# EAGLE schematic PCB0M3_1C (EAGLE 6.2)

## Sheet 1 of 7
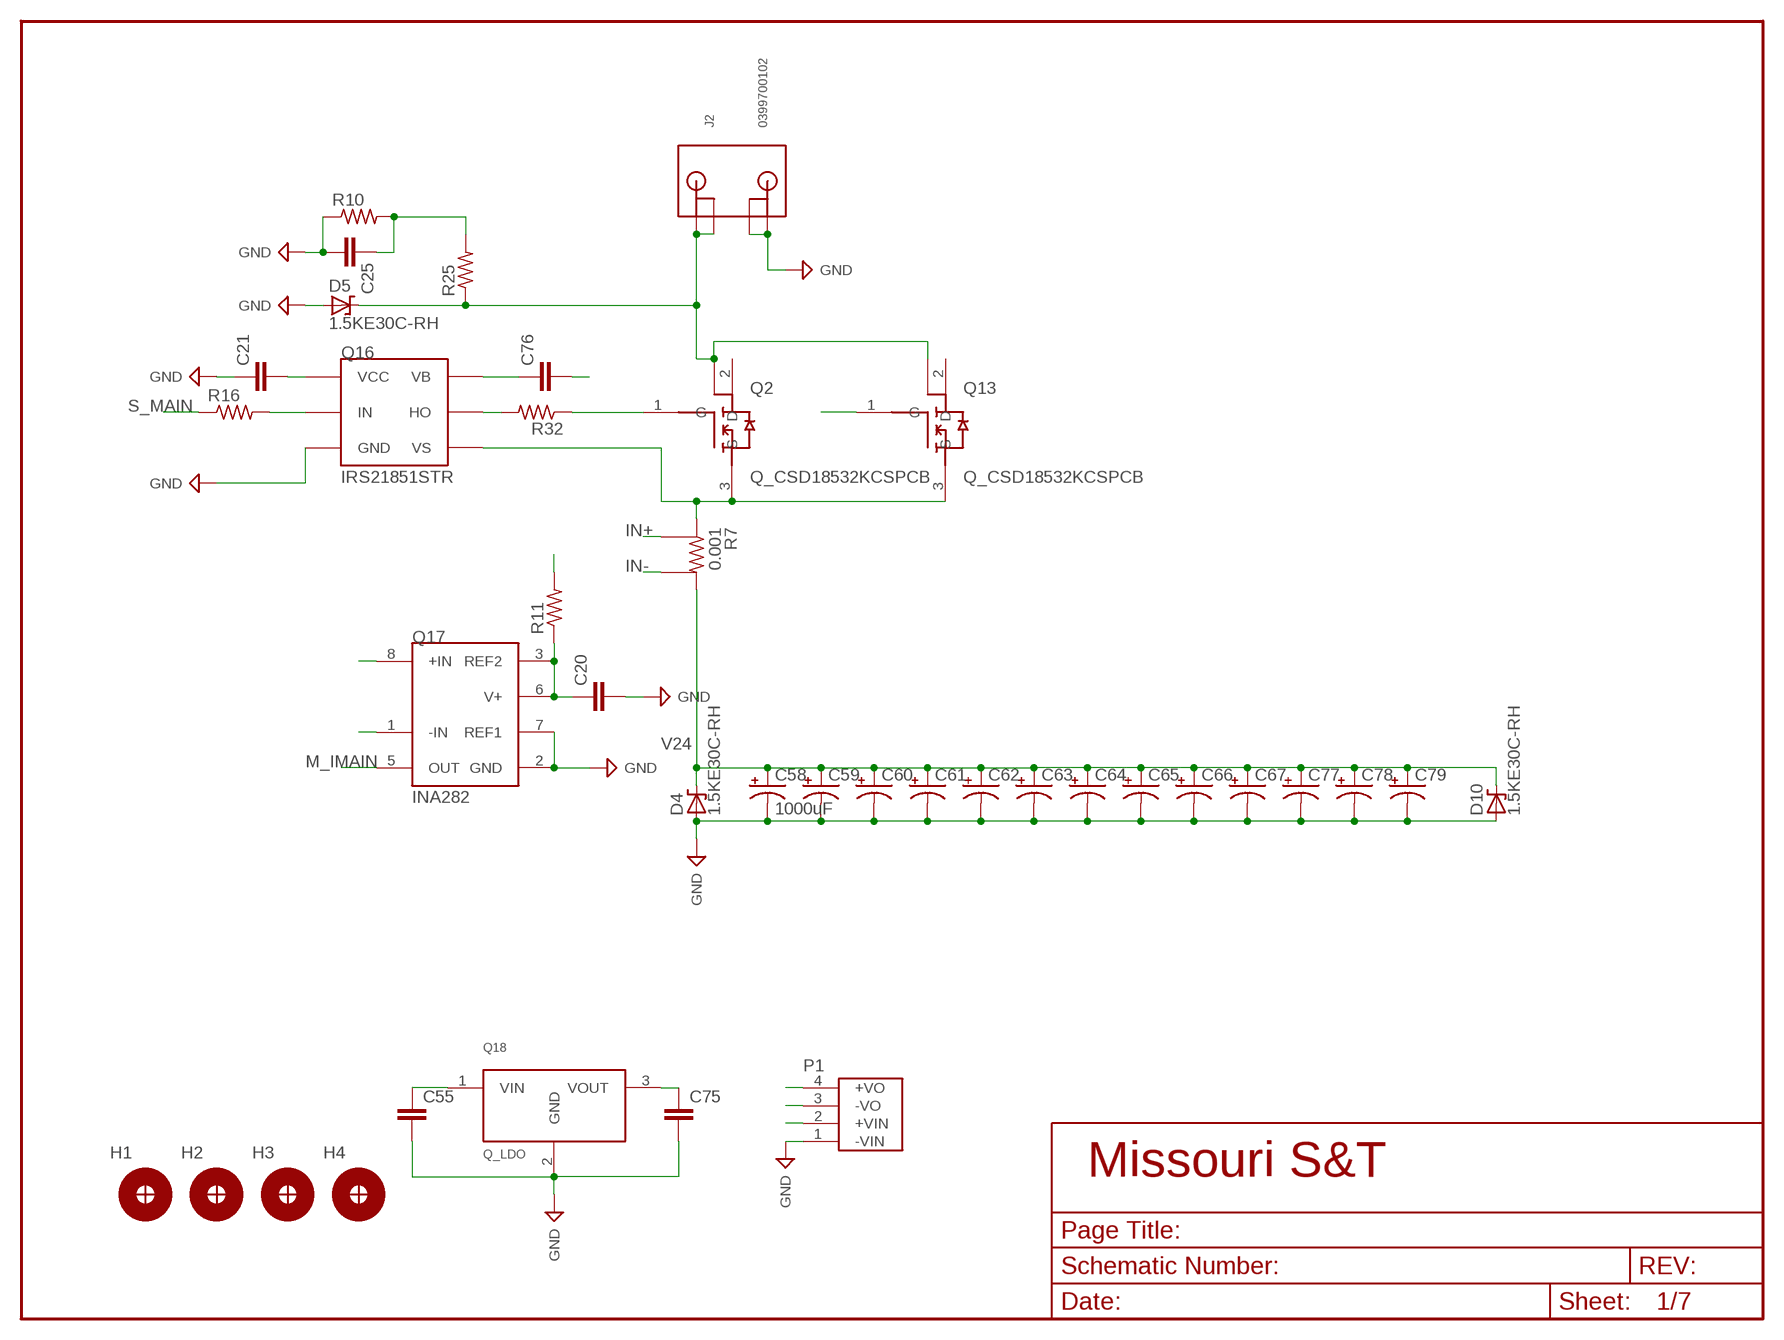
[diagram p0: schematic, sheet 1]

### Parts
C20  C_CAP_1206  [C_1206]
C21  C_CAP_1206  [C_1206]
C25  C_CAP_1206  [C_1206]
C55  C_CAP_1206  [C_1206]
C58  1000uF  C_POL10MM  [C_10MM]
C59  C_POL10MM  [C_10MM]
C60  C_POL10MM  [C_10MM]
C61  C_POL10MM  [C_10MM]
C62  C_POL10MM  [C_10MM]
C63  C_POL10MM  [C_10MM]
C64  C_POL10MM  [C_10MM]
C65  C_POL10MM  [C_10MM]
C66  C_POL10MM  [C_10MM]
C67  C_POL10MM  [C_10MM]
C75  C_CAP_1206  [C_1206]
C76  C_CAP_1206  [C_1206]
C77  C_POL10MM  [C_10MM]
C78  C_POL10MM  [C_10MM]
C79  C_POL10MM  [C_10MM]
D4  1.5KE30C-RH  D_1.5KE480A_D3.5MM_LS15.24MM  [DIODE_D3.5MM_LS15.24MM]
D5  1.5KE30C-RH  D_1.5KE480A_D3.5MM_LS15.24MM  [DIODE_D3.5MM_LS15.24MM]
D10  1.5KE30C-RH  D_1.5KE480A_D3.5MM_LS15.24MM  [DIODE_D3.5MM_LS15.24MM]
H1  H_MNTHOLE_#8  [H_MNTHOLE_#8]
H2  H_MNTHOLE_#8  [H_MNTHOLE_#8]
H3  H_MNTHOLE_#8  [H_MNTHOLE_#8]
H4  H_MNTHOLE_#8  [H_MNTHOLE_#8]
J2  0399700102  J_0399700102  [J_2CONHC]
P1  TME1215S  [TME1215S]
Q2  Q_CSD18532KCSPCB  [TO-220-FLAT]
Q13  Q_CSD18532KCSPCB  [TO-220-FLAT]
Q16  IRS21851STR  Q_IRS21851STR  [SOIC8]
Q17  INA282  Q_INA28  [SOIC8]
Q18  Q_LDO  [TO-220]
R7  0.001  R_FC4L110R001JER  [R_FC4L]
R10  R_RES_1206  [R_1206]
R11  R_1/4W  [R_1/4W]
R16  R_RES_1206  [R_1206]
R25  R_1/4W  [R_1/4W]
R32  R_RES_1206  [R_1206]

### Nets
+12V: C21.2 C75.1 P1.2(+VIN) Q16.1(VCC) Q18.3(VOUT)
GND: C20.2 C21.1 C25.2 C55.2 C58.P$2(-) C59.P$2(-) C60.P$2(-) C61.P$2(-) C62.P$2(-) C63.P$2(-) C64.P$2(-) C65.P$2(-) C66.P$2(-) C67.P$2(-) C75.2 C77.P$2(-) C78.P$2(-) C79.P$2(-) D4.A D5.A D10.A J2.PIN2-1(2-1) J2.PIN2-2(2-2) P1.1(-VIN) Q16.4(GND) Q17.2(GND) Q17.7(REF1) Q18.2(GND) R10.1 ; supply symbol labelled SUP_GND ; also sheet 2,3,4,5,6,7
HIGHSIDE: C76.1 P1.4(+VO) Q16.8(VB)
IN+: Q17.1(-IN) R7.SENSE1
IN-: Q17.8(+IN) R7.SENSE2
M_IMAIN: Q17.5(OUT) ; also sheet 7
M_VMAIN: C25.1 R10.2 R25.2 ; also sheet 7
MAINGATE: Q2.1(G) Q13.1(G) R32.1
N$45: C76.2 P1.3(-VO) Q2.3(S) Q13.3(S) Q16.6(VS) R7.1
N$46: Q16.7(HO) R32.2
N$47: Q16.2(IN) R16.2
N$48: C20.1 Q17.3(REF2) Q17.6(V+) R11.1
S_MAIN: R16.1 ; also sheet 7
V1: C55.1 D5.C(K) J2.PIN1-1(1-1) J2.PIN1-2(1-2) Q2.4 Q13.4 Q18.1(VIN) R25.1 ; also sheet 7
V24: C58.P$1(+) C59.P$1(+) C60.P$1(+) C61.P$1(+) C62.P$1(+) C63.P$1(+) C64.P$1(+) C65.P$1(+) C66.P$1(+) C67.P$1(+) C77.P$1(+) C78.P$1(+) C79.P$1(+) D4.C(K) D10.C(K) R7.2 ; also sheet 2,3,5,6
VA5: R11.2 ; also sheet 7
Unconnected: H1.1 H2.1 H3.1 H4.1 Q2.2(D) Q13.2(D)

## Sheet 2 of 7
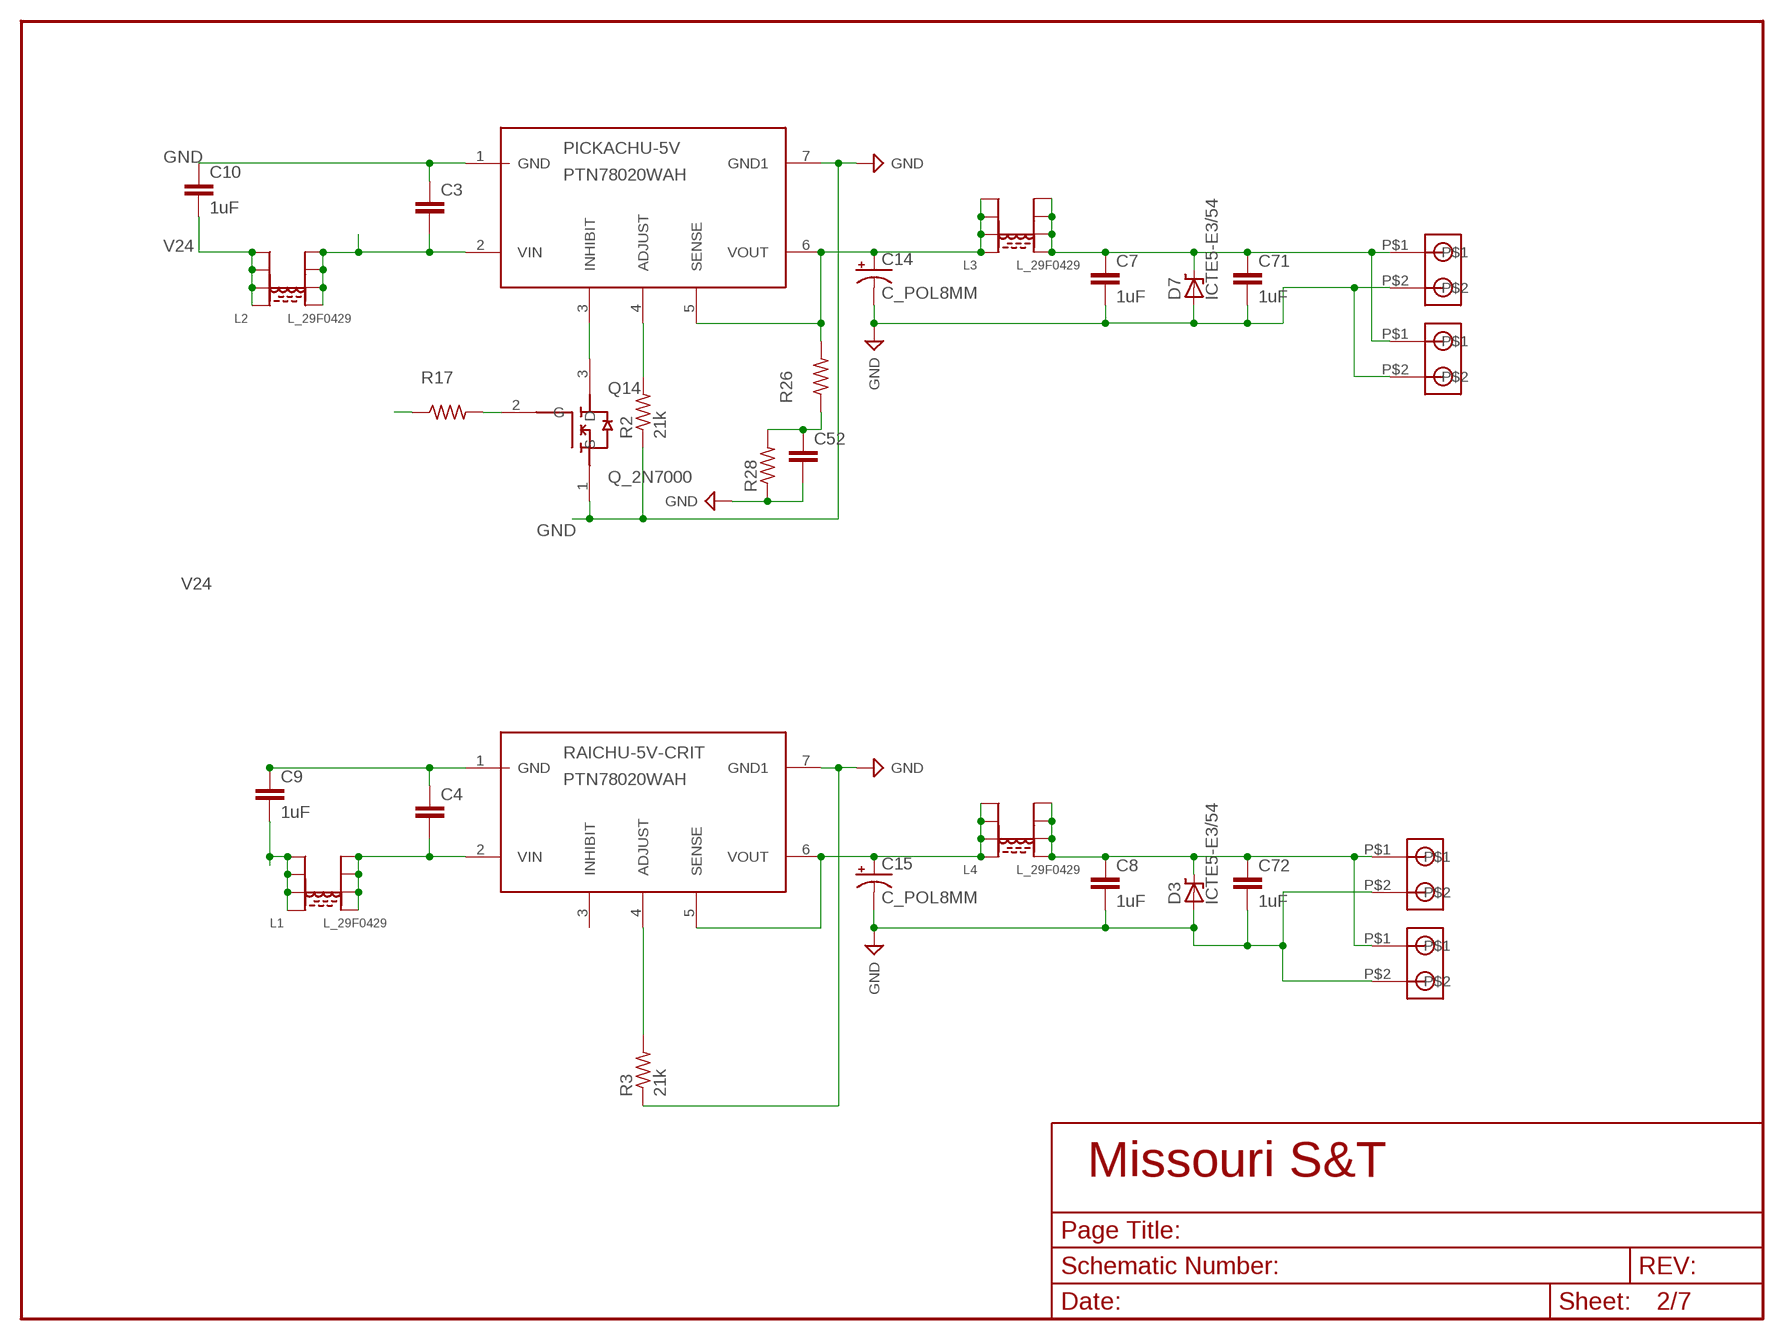
[diagram p1: schematic, sheet 2]

### Parts
C3  C_CAP_1206  [C_1206]
C4  C_CAP_1206  [C_1206]
C7  1uF  C_CAP_1206  [C_1206]
C8  1uF  C_CAP_1206  [C_1206]
C9  1uF  C_CAP_1206  [C_1206]
C10  1uF  C_CAP_1206  [C_1206]
C14  C_POL8MM  [C_8MM]
C15  C_POL8MM  [C_8MM]
C52  C_CAP_1206  [C_1206]
C71  1uF  C_CAP_1206  [C_1206]
C72  1uF  C_CAP_1206  [C_1206]
D3  ICTE5-E3/54  D_1.5KE480A_D3.5MM_LS15.24MM  [DIODE_D3.5MM_LS15.24MM]
D7  ICTE5-E3/54  D_1.5KE480A_D3.5MM_LS15.24MM  [DIODE_D3.5MM_LS15.24MM]
L1  L_29F0429  [L_29F0429]
L2  L_29F0429  [L_29F0429]
L3  L_29F0429  [L_29F0429]
L4  L_29F0429  [L_29F0429]
PICKACHU-5V  PTN78020WAH  Q_PTN78020  [R_PDSS-T7]
Q14  Q_2N7000  [TO-92-3]
R2  21k  R_1/4W  [R_1/4W]
R3  21k  R_1/4W  [R_1/4W]
R17  R_1/4WL  [R_1/4WL]
R26  R_1/4WL  [R_1/4WL]
R28  R_RES_1206  [R_1206]
RAICHU-5V-CRIT  PTN78020WAH  Q_PTN78020  [R_PDSS-T7]
U$52  J_1546074-2282834-2  [J_2.54MM]
U$53  J_1546074-2282834-2  [J_2.54MM]
U$54  J_1546074-2282834-2  [J_2.54MM]
U$55  J_1546074-2282834-2  [J_2.54MM]

### Nets
GND: C3.1 C4.1 C7.2 C8.2 C9.1 C10.1 C14.- C15.- C52.2 C71.2 C72.2 D3.A D7.A PICKACHU-5V.1(GND) PICKACHU-5V.7(GND1) Q14.1(S) R2.1 R3.1 R28.1 RAICHU-5V-CRIT.1(GND) RAICHU-5V-CRIT.7(GND1) U$52.P$2 U$53.P$2 U$54.P$2 U$55.P$2 ; supply symbol labelled SUP_GND ; also sheet 1,3,4,5,6,7
M_V5-2: C52.1 R26.1 R28.2 ; also sheet 7
N$3: Q14.2(G) R17.2
N$49: R3.2 RAICHU-5V-CRIT.4(ADJUST)
N$50: PICKACHU-5V.4(ADJUST) R2.2
N$53: C14.+ L3.1 L3.2 L3.3 L3.4 PICKACHU-5V.5(SENSE) PICKACHU-5V.6(VOUT) R26.2
N$54: C15.+ L4.1 L4.2 L4.3 L4.4 RAICHU-5V-CRIT.5(SENSE) RAICHU-5V-CRIT.6(VOUT)
N$65: C3.2 L2.5 L2.6 L2.7 L2.8 PICKACHU-5V.2(VIN)
N$103: PICKACHU-5V.3(INHIBIT) Q14.3(D)
N$112: C4.2 L1.5 L1.6 L1.7 L1.8 RAICHU-5V-CRIT.2(VIN)
S_V5-2: R17.1 ; also sheet 7
V5-CRT: C8.1 C72.1 D3.C(K) L4.5 L4.6 L4.7 L4.8 U$52.P$1 U$53.P$1
V12: C7.1 C71.1 D7.C(K) L3.5 L3.6 L3.7 L3.8 U$54.P$1 U$55.P$1
V24: C9.2 C10.2 L1.1 L1.2 L1.3 L1.4 L2.1 L2.2 L2.3 L2.4 ; also sheet 1,3,5,6
Unconnected: RAICHU-5V-CRIT.3(INHIBIT)

## Sheet 3 of 7
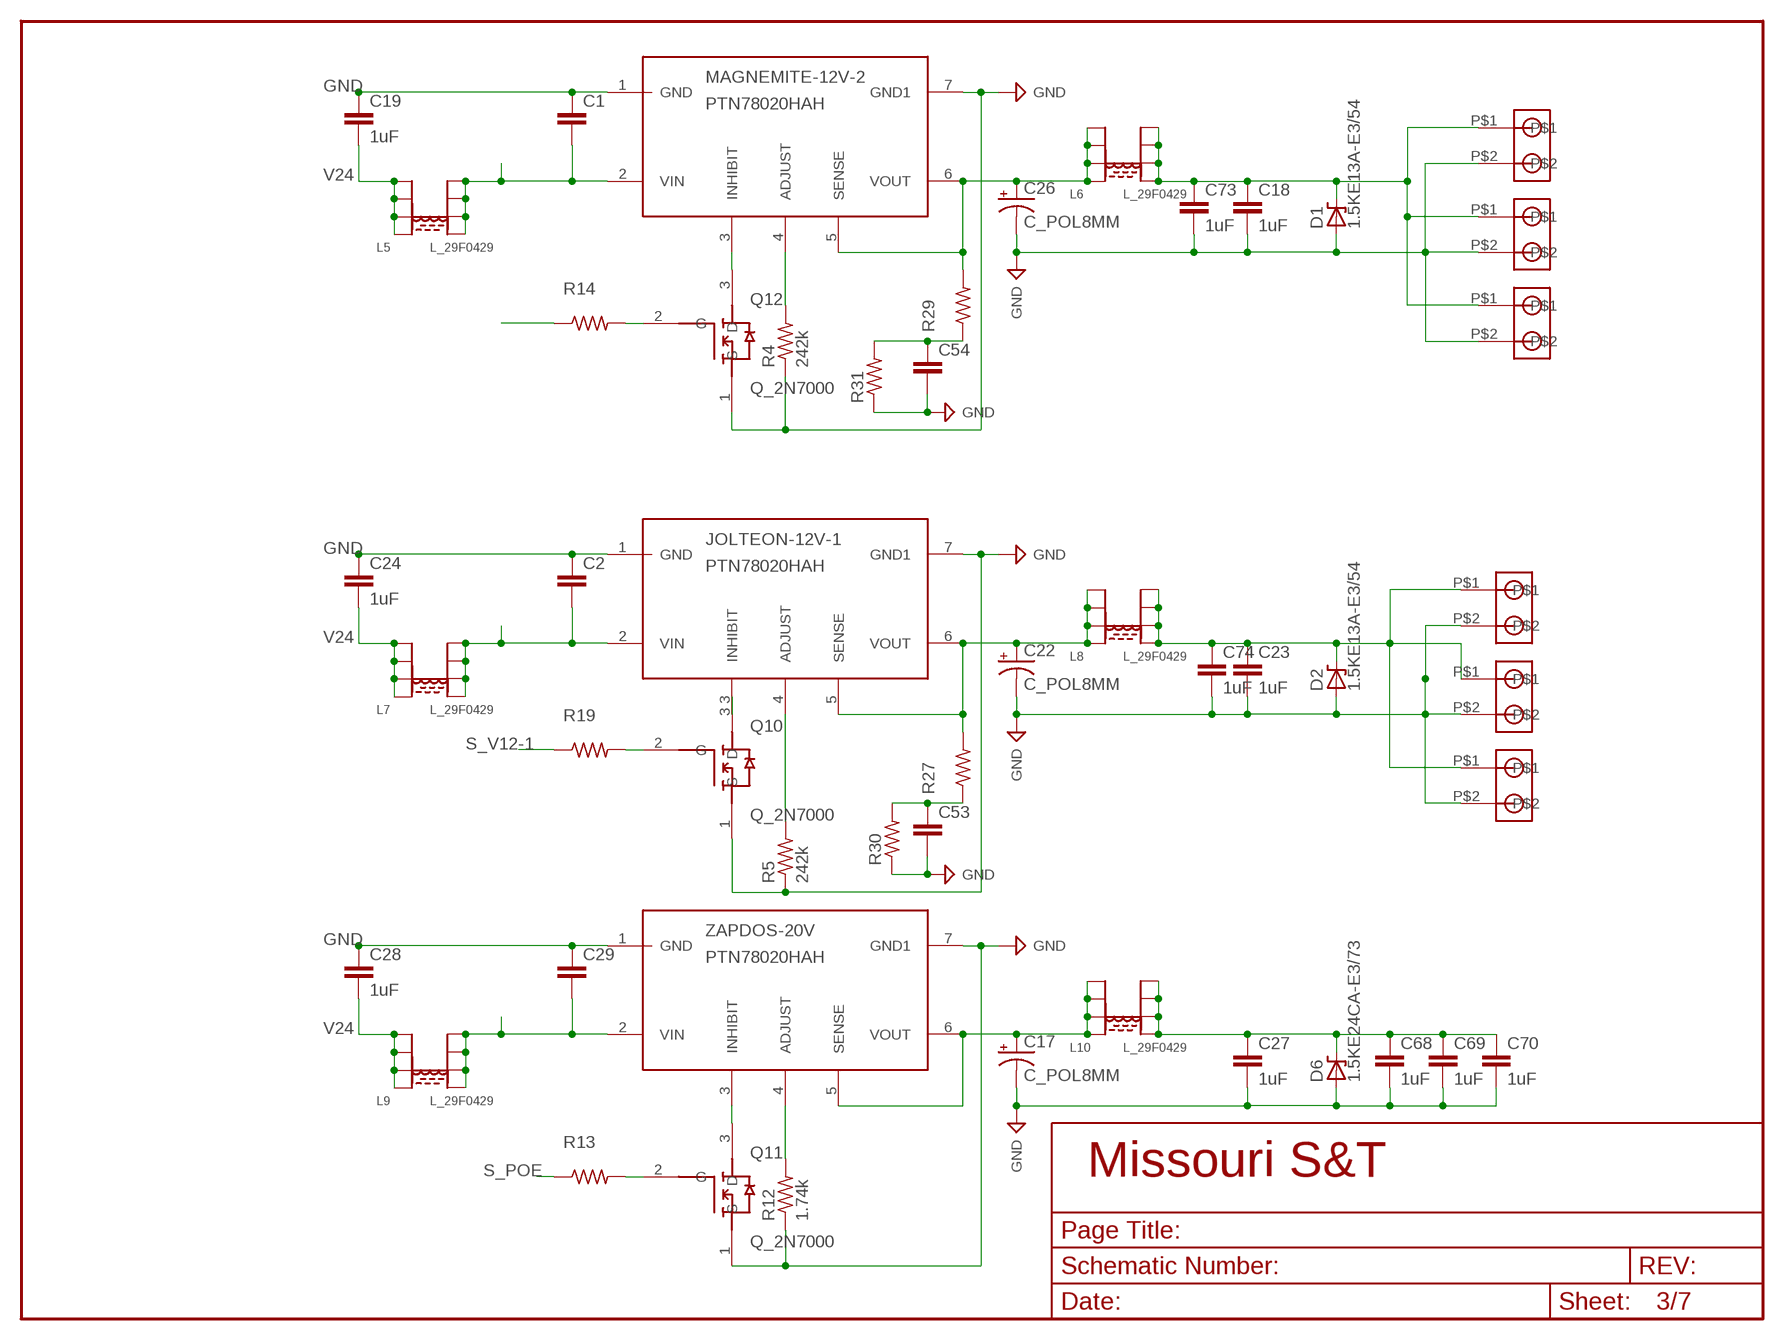
[diagram p2: schematic, sheet 3]

### Parts
C1  C_CAP_1206  [C_1206]
C2  C_CAP_1206  [C_1206]
C17  C_POL8MM  [C_8MM]
C18  1uF  C_CAP_1206  [C_1206]
C19  1uF  C_CAP_1206  [C_1206]
C22  C_POL8MM  [C_8MM]
C23  1uF  C_CAP_1206  [C_1206]
C24  1uF  C_CAP_1206  [C_1206]
C26  C_POL8MM  [C_8MM]
C27  1uF  C_CAP_1206  [C_1206]
C28  1uF  C_CAP_1206  [C_1206]
C29  C_CAP_1206  [C_1206]
C53  C_CAP_1206  [C_1206]
C54  C_CAP_1206  [C_1206]
C68  1uF  C_CAP_1206  [C_1206]
C69  1uF  C_CAP_1206  [C_1206]
C70  1uF  C_CAP_1206  [C_1206]
C73  1uF  C_CAP_1206  [C_1206]
C74  1uF  C_CAP_1206  [C_1206]
D1  1.5KE13A-E3/54  D_1.5KE480A_D3.5MM_LS15.24MM  [DIODE_D3.5MM_LS15.24MM]
D2  1.5KE13A-E3/54  D_1.5KE480A_D3.5MM_LS15.24MM  [DIODE_D3.5MM_LS15.24MM]
D6  1.5KE24CA-E3/73  D_1.5KE480A_D3.5MM_LS15.24MM  [DIODE_D3.5MM_LS15.24MM]
J3  J_1546074-2282834-2  [J_2.54MM]
J4  J_1546074-2282834-2  [J_2.54MM]
J5  J_1546074-2282834-2  [J_2.54MM]
J6  J_1546074-2282834-2  [J_2.54MM]
J7  J_1546074-2282834-2  [J_2.54MM]
J8  J_1546074-2282834-2  [J_2.54MM]
JOLTEON-12V-1  PTN78020HAH  Q_PTN78020  [R_PDSS-T7]
L5  L_29F0429  [L_29F0429]
L6  L_29F0429  [L_29F0429]
L7  L_29F0429  [L_29F0429]
L8  L_29F0429  [L_29F0429]
L9  L_29F0429  [L_29F0429]
L10  L_29F0429  [L_29F0429]
MAGNEMITE-12V-2  PTN78020HAH  Q_PTN78020  [R_PDSS-T7]
Q10  Q_2N7000  [TO-92-3]
Q11  Q_2N7000  [TO-92-3]
Q12  Q_2N7000  [TO-92-3]
R4  242k  R_1/4W  [R_1/4W]
R5  242k  R_1/4W  [R_1/4W]
R12  1.74k  R_1/4W  [R_1/4W]
R13  R_1/4WL  [R_1/4WL]
R14  R_1/4WL  [R_1/4WL]
R19  R_1/4WL  [R_1/4WL]
R27  R_1/4WL  [R_1/4WL]
R29  R_1/4WL  [R_1/4WL]
R30  R_RES_1206  [R_1206]
R31  R_RES_1206  [R_1206]
ZAPDOS-20V  PTN78020HAH  Q_PTN78020  [R_PDSS-T7]

### Nets
GND: C1.1 C2.1 C17.- C18.2 C19.1 C22.- C23.2 C24.1 C26.- C27.2 C28.1 C29.1 C53.2 C54.2 C68.2 C69.2 C70.2 C73.2 C74.2 D1.A D2.A D6.A J3.P$2 J4.P$2 J5.P$2 J6.P$2 J7.P$2 J8.P$2 JOLTEON-12V-1.1(GND) JOLTEON-12V-1.7(GND1) MAGNEMITE-12V-2.1(GND) MAGNEMITE-12V-2.7(GND1) Q10.1(S) Q11.1(S) Q12.1(S) R4.1 R5.1 R12.1 R30.1 R31.1 ZAPDOS-20V.1(GND) ZAPDOS-20V.7(GND1) ; supply symbol labelled SUP_GND ; also sheet 1,2,4,5,6,7
M_V12-1: C53.1 R27.1 R30.2 ; also sheet 7
M_V12-2: C54.1 R29.1 R31.2 ; also sheet 7
N$1: MAGNEMITE-12V-2.4(ADJUST) R4.2
N$2: C26.+ L6.1 L6.2 L6.3 L6.4 MAGNEMITE-12V-2.5(SENSE) MAGNEMITE-12V-2.6(VOUT) R29.2
N$4: JOLTEON-12V-1.4(ADJUST) R5.2
N$5: C22.+ JOLTEON-12V-1.5(SENSE) JOLTEON-12V-1.6(VOUT) L8.1 L8.2 L8.3 L8.4 R27.2
N$57: C1.2 L5.5 L5.6 L5.7 L5.8 MAGNEMITE-12V-2.2(VIN)
N$88: R12.2 ZAPDOS-20V.4(ADJUST)
N$97: C17.+ L10.1 L10.2 L10.3 L10.4 ZAPDOS-20V.5(SENSE) ZAPDOS-20V.6(VOUT)
N$98: C29.2 L9.5 L9.6 L9.7 L9.8 ZAPDOS-20V.2(VIN)
N$99: JOLTEON-12V-1.3(INHIBIT) Q10.3(D)
N$100: MAGNEMITE-12V-2.3(INHIBIT) Q12.3(D)
N$101: Q11.3(D) ZAPDOS-20V.3(INHIBIT)
N$110: C2.2 JOLTEON-12V-1.2(VIN) L7.5 L7.6 L7.7 L7.8
N$111: Q11.2(G) R13.2
N$113: Q10.2(G) R19.2
N$114: Q12.2(G) R14.2
S_12V-2: R14.1 ; also sheet 7
S_POE: R13.1 ; also sheet 7
S_V12-1: R19.1 ; also sheet 7
V15_1: C18.1 C73.1 D1.C(K) J6.P$1 J7.P$1 J8.P$1 L6.5 L6.6 L6.7 L6.8
V15_2: C23.1 C74.1 D2.C(K) J3.P$1 J4.P$1 J5.P$1 L8.5 L8.6 L8.7 L8.8
V24: C19.2 C24.2 C28.2 L5.1 L5.2 L5.3 L5.4 L7.1 L7.2 L7.3 L7.4 L9.1 L9.2 L9.3 L9.4 ; also sheet 1,2,5,6
V_POE: C27.1 C68.1 C69.1 C70.1 D6.C(K) L10.5 L10.6 L10.7 L10.8 ; also sheet 4

## Sheet 4 of 7
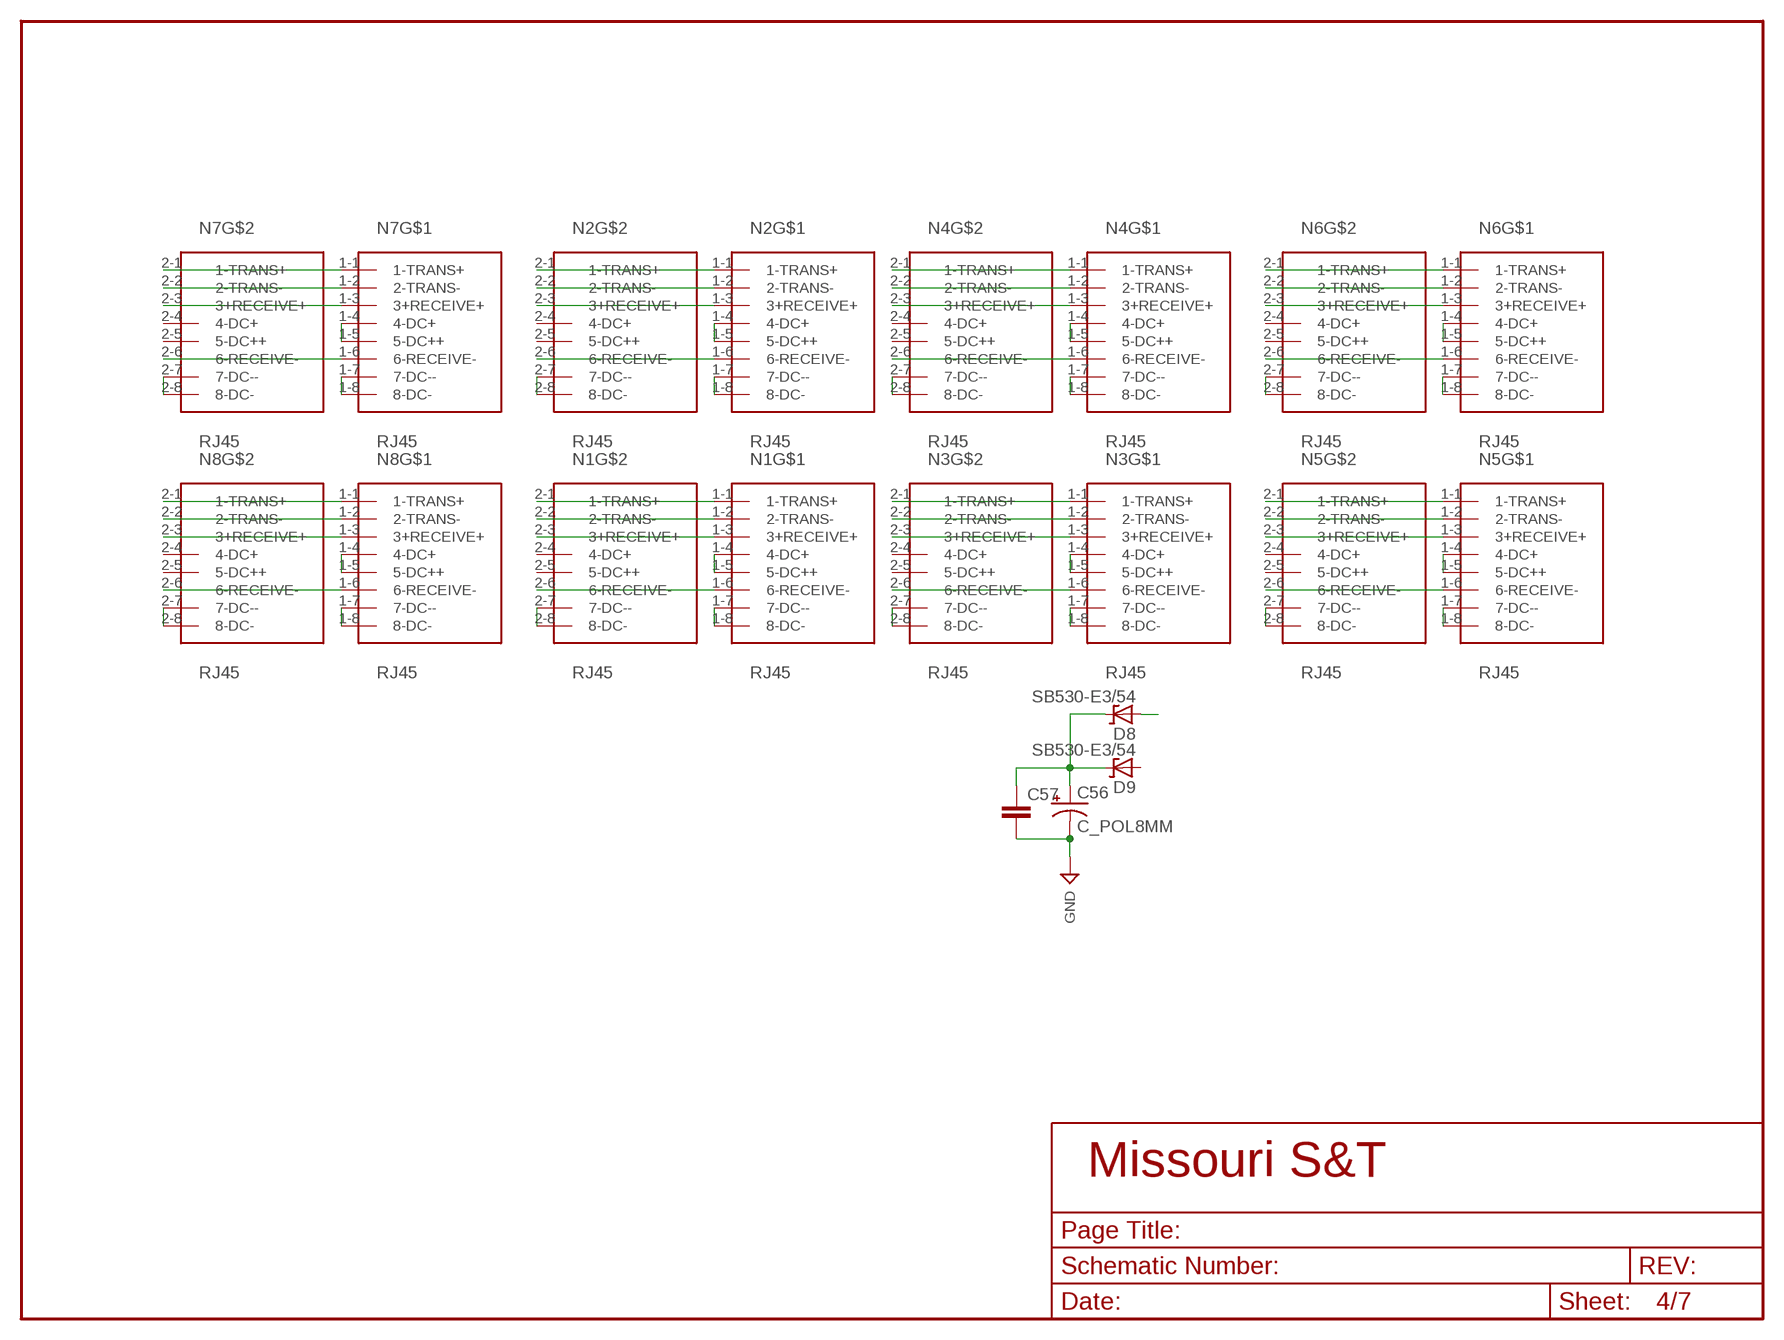
[diagram p3: schematic, sheet 4]

### Parts
C56  C_POL8MM  [C_8MM]
C57  C_CAP_1206  [C_1206]
D8  SB530-E3/54  D_1.5KE480A_D3.5MM_LS15.24MM  [DIODE_D3.5MM_LS15.24MM]
D9  SB530-E3/54  D_1.5KE480A_D3.5MM_LS15.24MM  [DIODE_D3.5MM_LS15.24MM]
N1  RJ45  RJ45-2PORT  [RJ45-CAT5E-2PACK]
N2  RJ45  RJ45-2PORT  [RJ45-CAT5E-2PACK]
N3  RJ45  RJ45-2PORT  [RJ45-CAT5E-2PACK]
N4  RJ45  RJ45-2PORT  [RJ45-CAT5E-2PACK]
N5  RJ45  RJ45-2PORT  [RJ45-CAT5E-2PACK]
N6  RJ45  RJ45-2PORT  [RJ45-CAT5E-2PACK]
N7  RJ45  RJ45-2PORT  [RJ45-CAT5E-2PACK]
N8  RJ45  RJ45-2PORT  [RJ45-CAT5E-2PACK]

### Nets
GND: C56.- C57.2 N1.1-7(7-DC--) N1.1-8(8-DC-) N1.2-7(7-DC--) N1.2-8(8-DC-) N2.1-7(7-DC--) N2.1-8(8-DC-) N2.2-7(7-DC--) N2.2-8(8-DC-) N3.1-7(7-DC--) N3.1-8(8-DC-) N3.2-7(7-DC--) N3.2-8(8-DC-) N4.1-7(7-DC--) N4.1-8(8-DC-) N4.2-7(7-DC--) N4.2-8(8-DC-) N5.1-7(7-DC--) N5.1-8(8-DC-) N5.2-7(7-DC--) N5.2-8(8-DC-) N6.1-7(7-DC--) N6.1-8(8-DC-) N6.2-7(7-DC--) N6.2-8(8-DC-) N7.1-7(7-DC--) N7.1-8(8-DC-) N7.2-7(7-DC--) N7.2-8(8-DC-) N8.1-7(7-DC--) N8.1-8(8-DC-) N8.2-7(7-DC--) N8.2-8(8-DC-) ; supply symbol labelled SUP_GND ; also sheet 1,2,3,5,6,7
N$7: N6.1-1(1-TRANS+) N6.2-1(1-TRANS+)
N$8: N6.1-2(2-TRANS-) N6.2-2(2-TRANS-)
N$9: N6.1-3(3+RECEIVE+) N6.2-3(3+RECEIVE+)
N$10: N6.1-6(6-RECEIVE-) N6.2-6(6-RECEIVE-)
N$11: N5.1-1(1-TRANS+) N5.2-1(1-TRANS+)
N$12: N5.1-2(2-TRANS-) N5.2-2(2-TRANS-)
N$13: N5.1-3(3+RECEIVE+) N5.2-3(3+RECEIVE+)
N$14: N5.1-6(6-RECEIVE-) N5.2-6(6-RECEIVE-)
N$15: N4.1-1(1-TRANS+) N4.2-1(1-TRANS+)
N$16: N4.1-2(2-TRANS-) N4.2-2(2-TRANS-)
N$17: N4.1-3(3+RECEIVE+) N4.2-3(3+RECEIVE+)
N$18: N4.1-6(6-RECEIVE-) N4.2-6(6-RECEIVE-)
N$19: N3.1-1(1-TRANS+) N3.2-1(1-TRANS+)
N$20: N3.1-2(2-TRANS-) N3.2-2(2-TRANS-)
N$21: N3.1-6(6-RECEIVE-) N3.2-6(6-RECEIVE-)
N$22: N2.1-1(1-TRANS+) N2.2-1(1-TRANS+)
N$23: N2.1-2(2-TRANS-) N2.2-2(2-TRANS-)
N$24: N2.1-3(3+RECEIVE+) N2.2-3(3+RECEIVE+)
N$25: N2.1-6(6-RECEIVE-) N2.2-6(6-RECEIVE-)
N$26: N1.1-1(1-TRANS+) N1.2-1(1-TRANS+)
N$27: N1.1-2(2-TRANS-) N1.2-2(2-TRANS-)
N$28: N1.1-3(3+RECEIVE+) N1.2-3(3+RECEIVE+)
N$29: N1.1-6(6-RECEIVE-) N1.2-6(6-RECEIVE-)
N$30: N3.1-3(3+RECEIVE+) N3.2-3(3+RECEIVE+)
N$31: N7.1-1(1-TRANS+) N7.2-1(1-TRANS+)
N$32: N7.1-2(2-TRANS-) N7.2-2(2-TRANS-)
N$33: N7.1-3(3+RECEIVE+) N7.2-3(3+RECEIVE+)
N$34: N7.1-6(6-RECEIVE-) N7.2-6(6-RECEIVE-)
N$35: N8.1-1(1-TRANS+) N8.2-1(1-TRANS+)
N$36: N8.1-2(2-TRANS-) N8.2-2(2-TRANS-)
N$37: N8.1-3(3+RECEIVE+) N8.2-3(3+RECEIVE+)
N$38: N8.1-6(6-RECEIVE-) N8.2-6(6-RECEIVE-)
V_ANTENNA: C56.+ C57.1 D8.C(K) D9.C(K) N1.1-4(4-DC+) N1.1-5(5-DC++)
V_POE: D8.A N2.1-4(4-DC+) N2.1-5(5-DC++) N3.1-4(4-DC+) N3.1-5(5-DC++) N4.1-4(4-DC+) N4.1-5(5-DC++) N5.1-4(4-DC+) N5.1-5(5-DC++) N6.1-4(4-DC+) N6.1-5(5-DC++) N7.1-4(4-DC+) N7.1-5(5-DC++) N8.1-4(4-DC+) N8.1-5(5-DC++) ; also sheet 3
Unconnected: D9.A N1.2-4(4-DC+) N1.2-5(5-DC++) N2.2-4(4-DC+) N2.2-5(5-DC++) N3.2-4(4-DC+) N3.2-5(5-DC++) N4.2-4(4-DC+) N4.2-5(5-DC++) N5.2-4(4-DC+) N5.2-5(5-DC++) N6.2-4(4-DC+) N6.2-5(5-DC++) N7.2-4(4-DC+) N7.2-5(5-DC++) N8.2-4(4-DC+) N8.2-5(5-DC++)

## Sheet 5 of 7
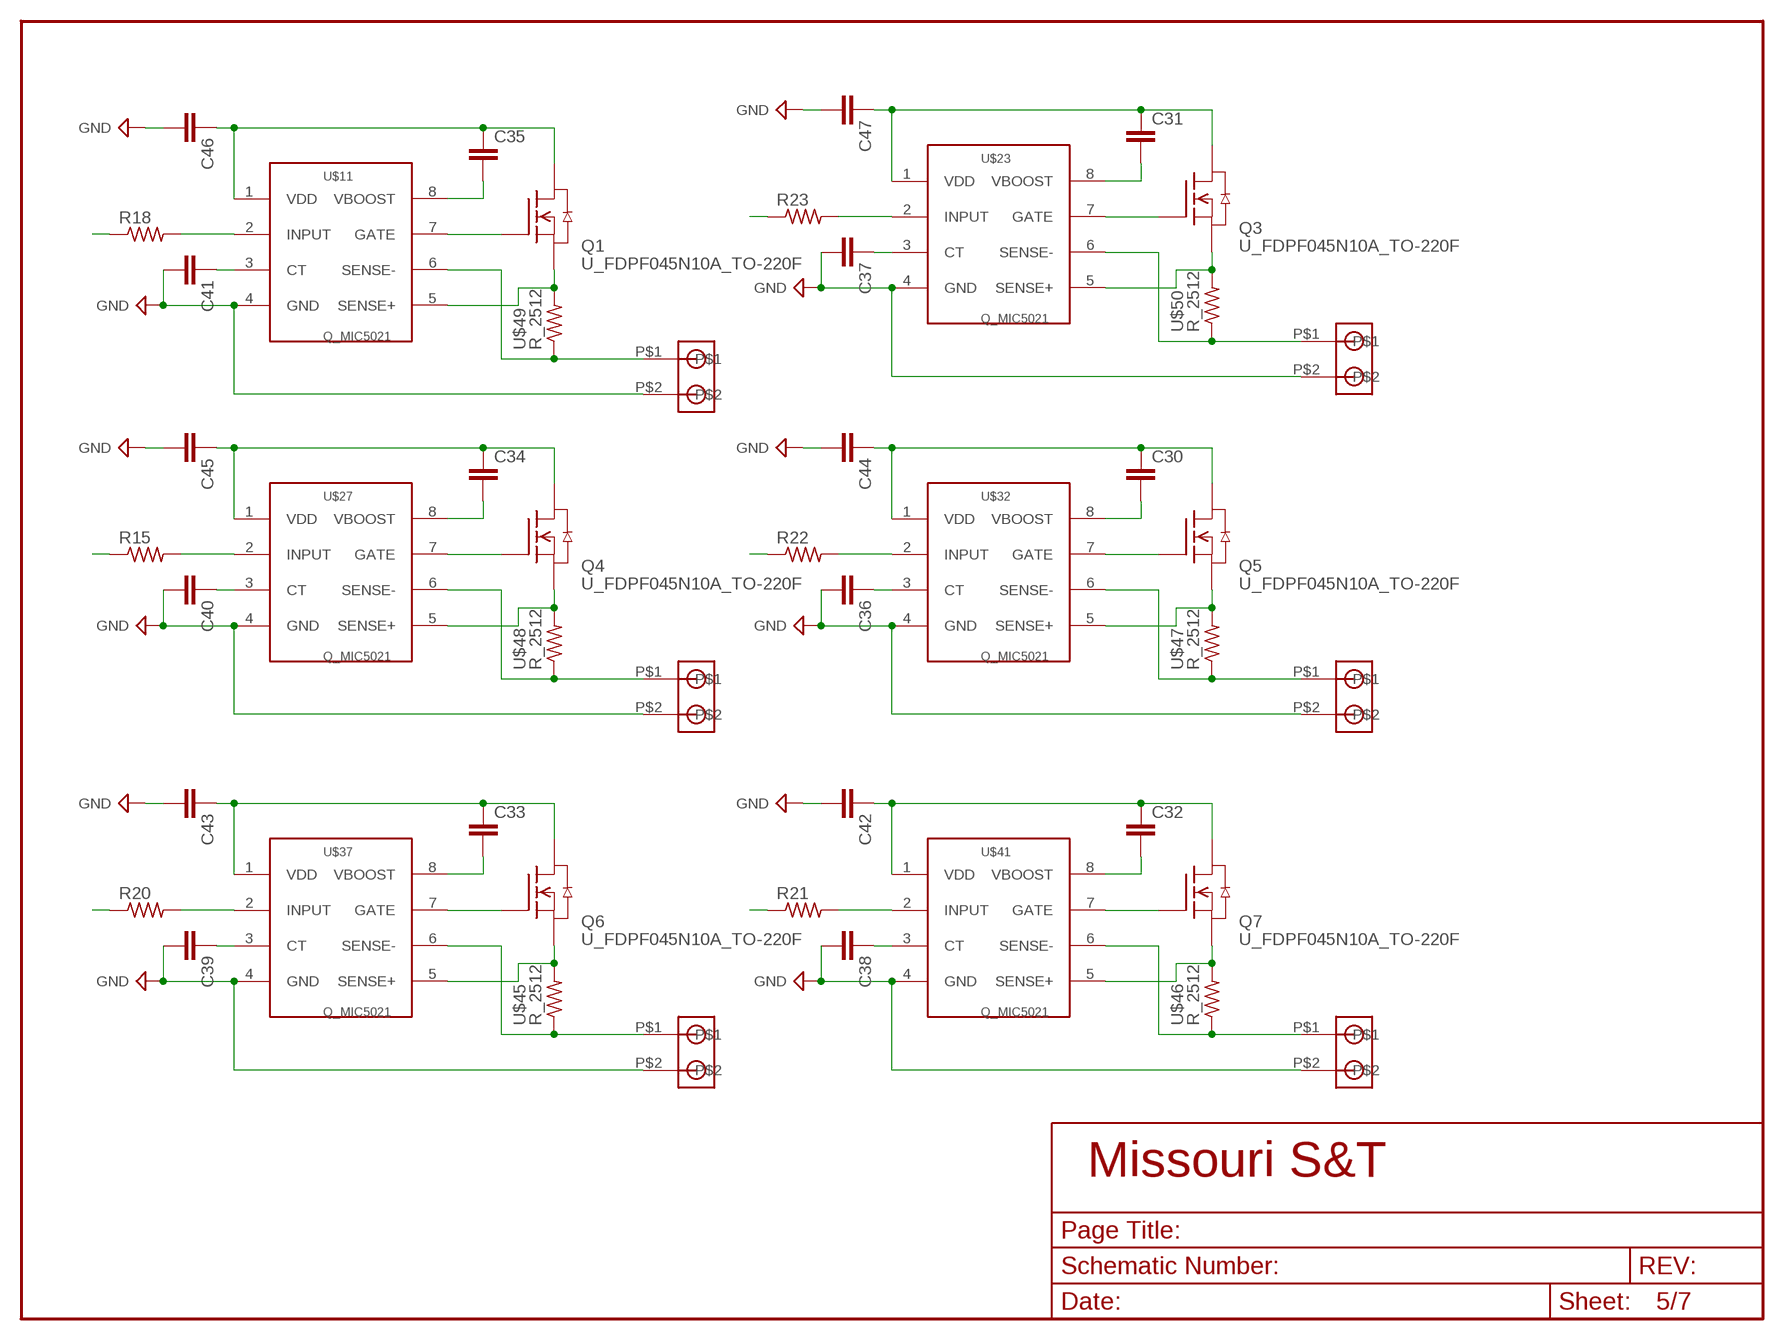
[diagram p4: schematic, sheet 5]

### Parts
C30  C_CAP_1206  [C_1206]
C31  C_CAP_1206  [C_1206]
C32  C_CAP_1206  [C_1206]
C33  C_CAP_1206  [C_1206]
C34  C_CAP_1206  [C_1206]
C35  C_CAP_1206  [C_1206]
C36  C_CAP_1206  [C_1206]
C37  C_CAP_1206  [C_1206]
C38  C_CAP_1206  [C_1206]
C39  C_CAP_1206  [C_1206]
C40  C_CAP_1206  [C_1206]
C41  C_CAP_1206  [C_1206]
C42  C_CAP_1206  [C_1206]
C43  C_CAP_1206  [C_1206]
C44  C_CAP_1206  [C_1206]
C45  C_CAP_1206  [C_1206]
C46  C_CAP_1206  [C_1206]
C47  C_CAP_1206  [C_1206]
Q1  U_FDPF045N10A_TO-220F  [TO220F]
Q3  U_FDPF045N10A_TO-220F  [TO220F]
Q4  U_FDPF045N10A_TO-220F  [TO220F]
Q5  U_FDPF045N10A_TO-220F  [TO220F]
Q6  U_FDPF045N10A_TO-220F  [TO220F]
Q7  U_FDPF045N10A_TO-220F  [TO220F]
R15  R_RES_1206  [R_1206]
R18  R_RES_1206  [R_1206]
R20  R_RES_1206  [R_1206]
R21  R_RES_1206  [R_1206]
R22  R_RES_1206  [R_1206]
R23  R_RES_1206  [R_1206]
U$11  Q_MIC5021  [DIP8]
U$14  J_1546074-2  [THERM_BLOCK_2]
U$23  Q_MIC5021  [DIP8]
U$26  J_1546074-2  [THERM_BLOCK_2]
U$27  Q_MIC5021  [DIP8]
U$31  J_1546074-2  [THERM_BLOCK_2]
U$32  Q_MIC5021  [DIP8]
U$36  J_1546074-2  [THERM_BLOCK_2]
U$37  Q_MIC5021  [DIP8]
U$40  J_1546074-2  [THERM_BLOCK_2]
U$41  Q_MIC5021  [DIP8]
U$44  J_1546074-2  [THERM_BLOCK_2]
U$45  R_2512  [R_2512]
U$46  R_2512  [R_2512]
U$47  R_2512  [R_2512]
U$48  R_2512  [R_2512]
U$49  R_2512  [R_2512]
U$50  R_2512  [R_2512]

### Nets
GND: C36.2 C37.2 C38.2 C39.2 C40.2 C41.2 C42.2 C43.2 C44.2 C45.2 C46.2 C47.2 U$11.4(GND) U$14.P$2 U$23.4(GND) U$26.P$2 U$27.4(GND) U$31.P$2 U$32.4(GND) U$36.P$2 U$37.4(GND) U$40.P$2 U$41.4(GND) U$44.P$2 ; supply symbol labelled SUP_GND ; also sheet 1,2,3,4,6,7
N$39: Q1.3(S) U$11.5(SENSE+) U$49.P$2
N$40: U$11.6(SENSE-) U$14.P$1 U$49.P$1
N$41: Q1.1(G) U$11.7(GATE)
N$42: R18.2 U$11.2(INPUT)
N$43: C35.2 U$11.8(VBOOST)
N$52: Q3.3(S) U$23.5(SENSE+) U$50.P$2
N$55: U$23.6(SENSE-) U$26.P$1 U$50.P$1
N$56: Q3.1(G) U$23.7(GATE)
N$58: R23.2 U$23.2(INPUT)
N$59: C31.2 U$23.8(VBOOST)
N$60: Q4.3(S) U$27.5(SENSE+) U$48.P$2
N$61: U$27.6(SENSE-) U$31.P$1 U$48.P$1
N$62: Q4.1(G) U$27.7(GATE)
N$63: R15.2 U$27.2(INPUT)
N$64: C34.2 U$27.8(VBOOST)
N$66: Q5.3(S) U$32.5(SENSE+) U$47.P$2
N$67: U$32.6(SENSE-) U$36.P$1 U$47.P$1
N$68: Q5.1(G) U$32.7(GATE)
N$69: R22.2 U$32.2(INPUT)
N$70: C30.2 U$32.8(VBOOST)
N$71: Q6.3(S) U$37.5(SENSE+) U$45.P$2
N$72: U$37.6(SENSE-) U$40.P$1 U$45.P$1
N$73: Q6.1(G) U$37.7(GATE)
N$74: R20.2 U$37.2(INPUT)
N$75: C33.2 U$37.8(VBOOST)
N$76: Q7.3(S) U$41.5(SENSE+) U$46.P$2
N$77: U$41.6(SENSE-) U$44.P$1 U$46.P$1
N$78: Q7.1(G) U$41.7(GATE)
N$79: R21.2 U$41.2(INPUT)
N$80: C32.2 U$41.8(VBOOST)
N$104: C41.1 U$11.3(CT)
N$105: C37.1 U$23.3(CT)
N$106: C36.1 U$32.3(CT)
N$107: C38.1 U$41.3(CT)
N$108: C39.1 U$37.3(CT)
N$109: C40.1 U$27.3(CT)
S_MC1: R22.1 ; also sheet 7
S_MC2: R21.1 ; also sheet 7
S_MC3: R20.1 ; also sheet 7
S_MC4: R18.1 ; also sheet 7
S_MC5: R15.1 ; also sheet 7
S_MC6: R23.1 ; also sheet 7
V24: C30.1 C31.1 C32.1 C33.1 C34.1 C35.1 C42.1 C43.1 C44.1 C45.1 C46.1 C47.1 Q1.2(D) Q3.2(D) Q4.2(D) Q5.2(D) Q6.2(D) Q7.2(D) U$11.1(VDD) U$23.1(VDD) U$27.1(VDD) U$32.1(VDD) U$37.1(VDD) U$41.1(VDD) ; also sheet 1,2,3,6

## Sheet 6 of 7
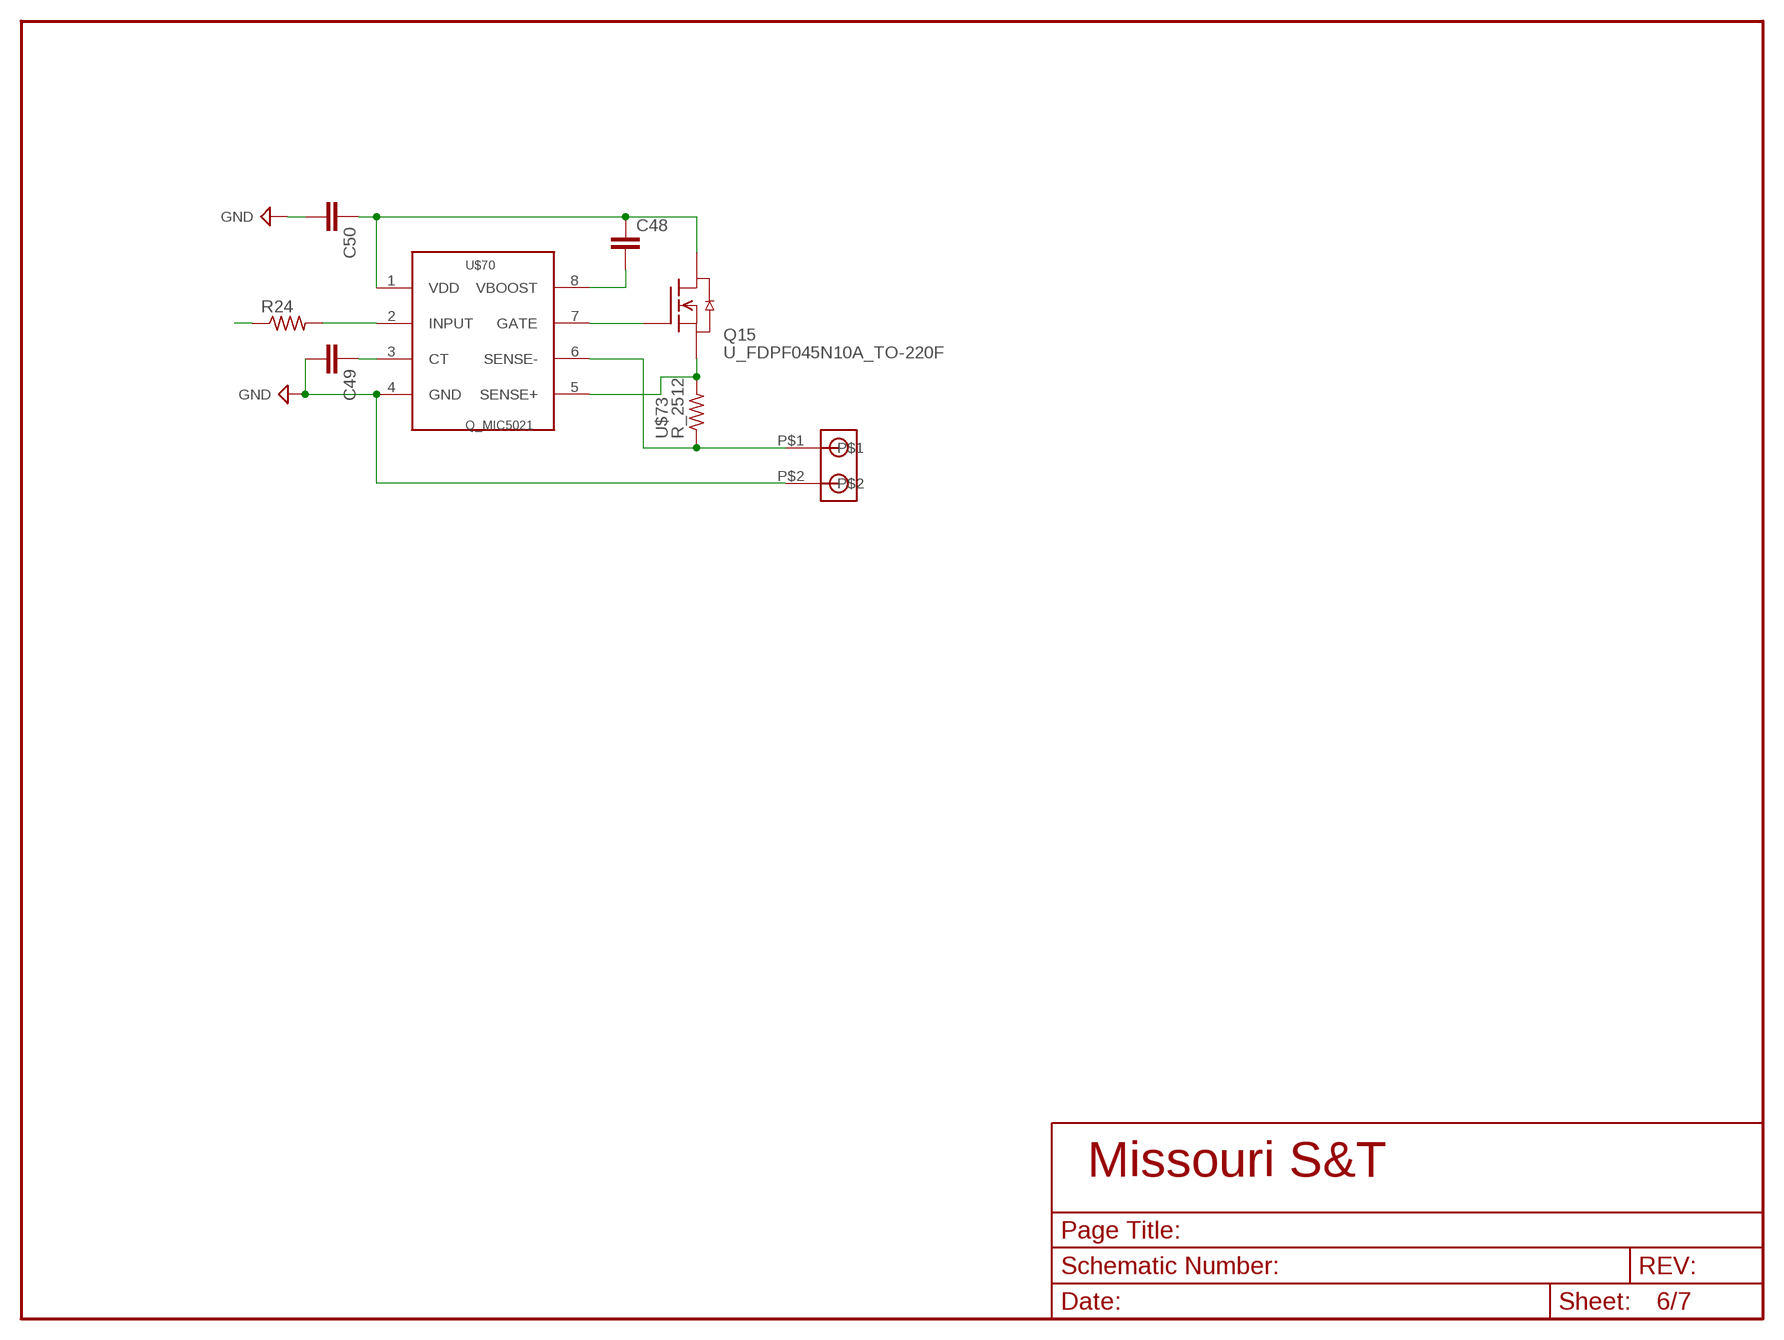
[diagram p5: schematic, sheet 6]

### Parts
C48  C_CAP_1206  [C_1206]
C49  C_CAP_1206  [C_1206]
C50  C_CAP_1206  [C_1206]
Q15  U_FDPF045N10A_TO-220F  [TO220F]
R24  R_RES_1206  [R_1206]
U$70  Q_MIC5021  [DIP8]
U$72  J_1546074-2  [THERM_BLOCK_2]
U$73  R_2512  [R_2512]

### Nets
GND: C49.2 C50.2 U$70.4(GND) U$72.P$2 ; supply symbol labelled SUP_GND ; also sheet 1,2,3,4,5,7
N$81: Q15.3(S) U$70.5(SENSE+) U$73.P$2
N$94: U$70.6(SENSE-) U$72.P$1 U$73.P$1
N$115: Q15.1(G) U$70.7(GATE)
N$116: C48.2 U$70.8(VBOOST)
N$117: C49.1 U$70.3(CT)
N$118: R24.2 U$70.2(INPUT)
S_V24AUX: R24.1 ; also sheet 7
V24: C48.1 C50.1 Q15.2(D) U$70.1(VDD) ; also sheet 1,2,3,5

## Sheet 7 of 7
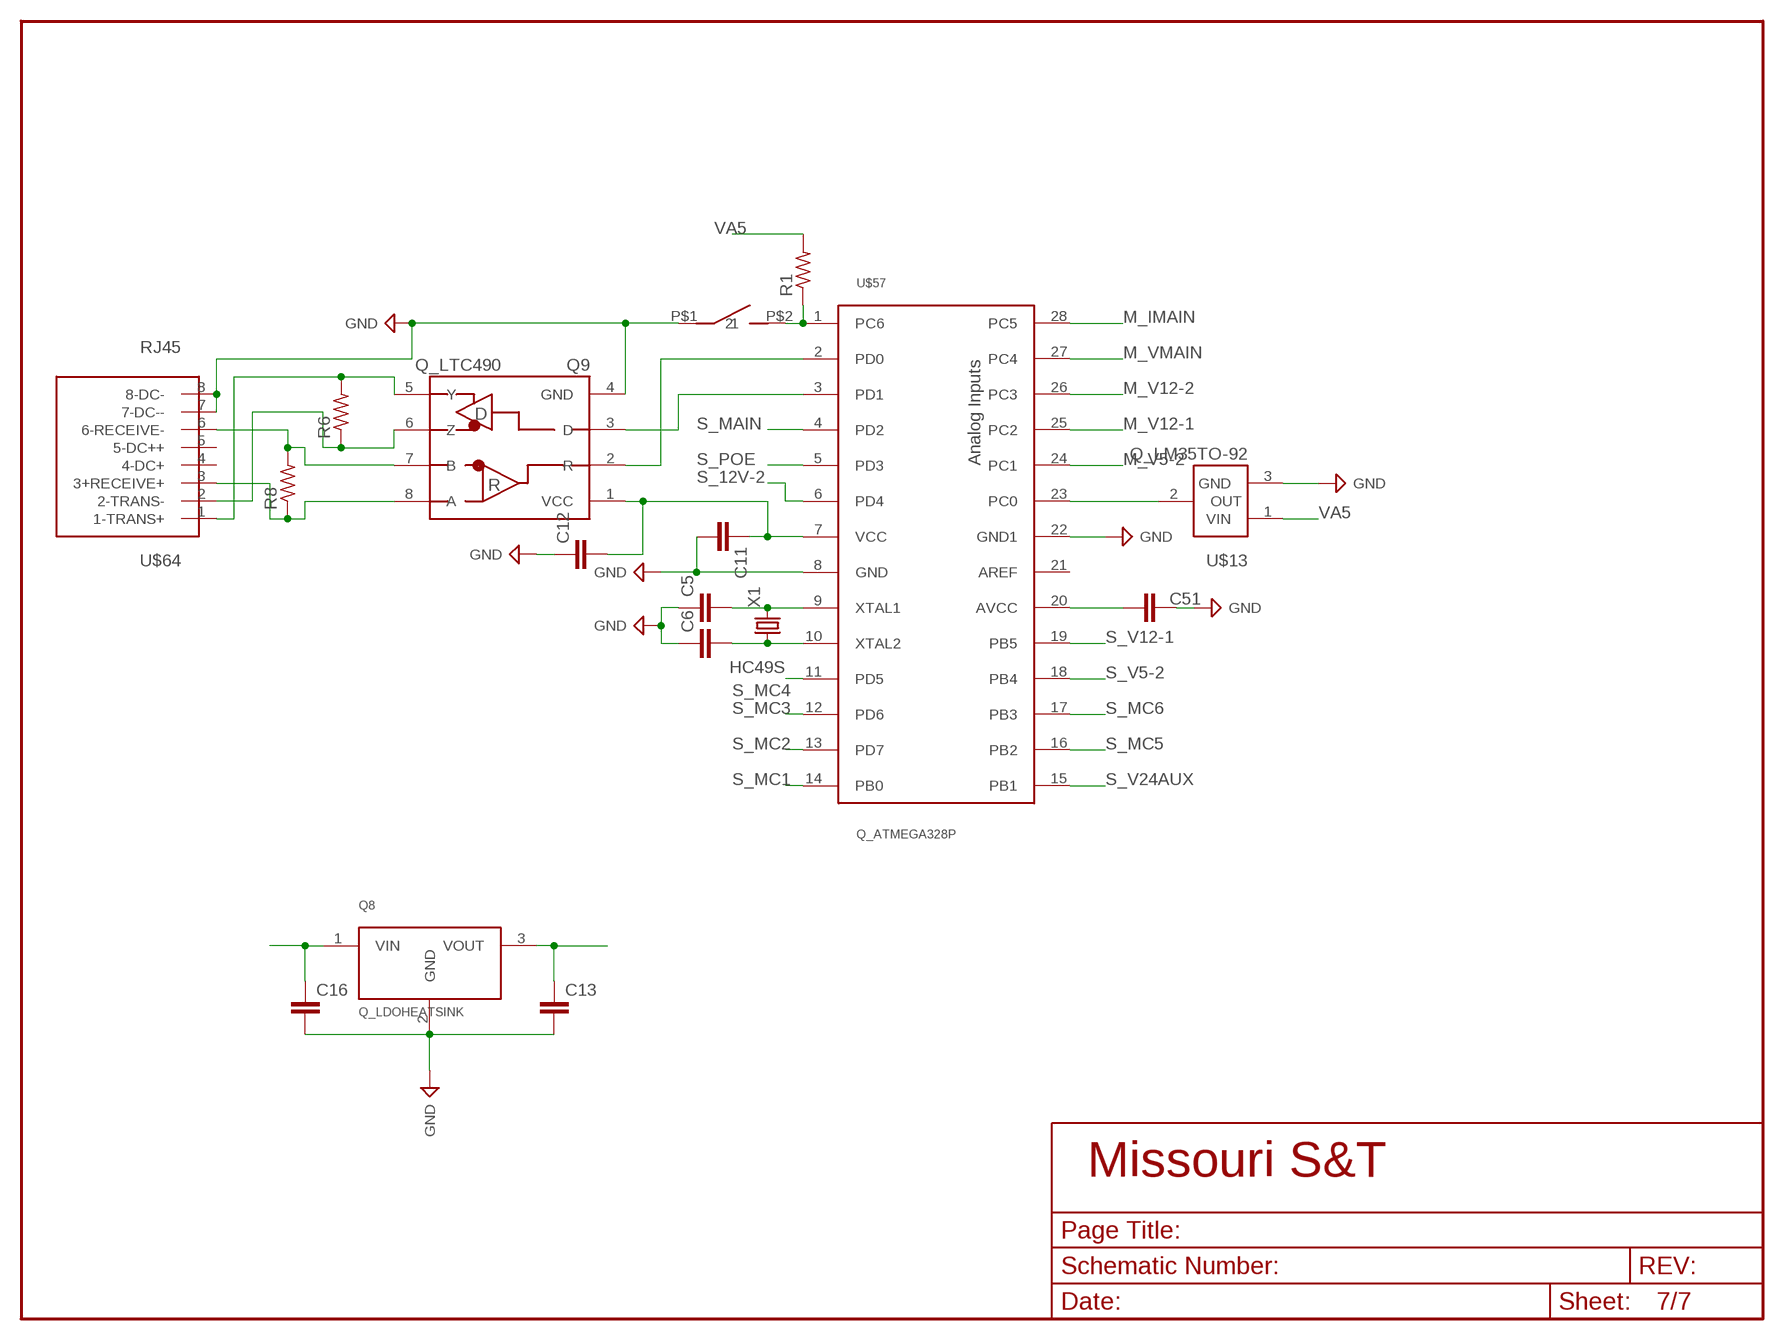
[diagram p6: schematic, sheet 7]

### Parts
C5  C_CAP_1206  [C_1206]
C6  C_CAP_1206  [C_1206]
C11  C_CAP_1206  [C_1206]
C12  C_CAP_1206  [C_1206]
C13  C_CAP_1206  [C_1206]
C16  C_CAP_1206  [C_1206]
C51  C_CAP_1206  [C_1206]
J1  J_MC32857  [J_TOGGLE]
Q8  Q_LDOHEATSINK  [TO220_6025DG]
Q9  Q_LTC490  [DIP8]
R1  R_RES_1206  [R_1206]
R6  R_RES_1206  [R_1206]
R8  R_RES_1206  [R_1206]
U$13  Q_LM35TO-92  [TO-92-3]
U$57  Q_ATMEGA328P  [DIP28]
U$64  RJ45  [RJ45-CAT5E]
X1  HC49S  X_HC49SCRYSTAL  [HC-49]

### Nets
GND: C5.1 C6.1 C11.2 C12.1 C13.2 C16.2 C51.1 J1.P$1 Q8.2(GND) Q9.4(GND) U$13.3(GND) U$57.8(GND) U$57.22(GND1) U$64.7(7-DC--) U$64.8(8-DC-) ; supply symbol labelled SUP_GND ; also sheet 1,2,3,4,5,6
M_IMAIN: U$57.28(PC5) ; also sheet 1
M_V5-2: U$57.24(PC1) ; also sheet 2
M_V12-1: U$57.25(PC2) ; also sheet 3
M_V12-2: U$57.26(PC3) ; also sheet 3
M_VMAIN: U$57.27(PC4) ; also sheet 1
N$6: U$13.2(OUT) U$57.23(PC0)
N$82: C5.2 U$57.9(XTAL1) X1.P$2
N$83: C6.2 U$57.10(XTAL2) X1.P$1
N$84: Q9.2(R) U$57.2(PD0)
N$86: J1.P$2 R1.1 U$57.1(PC6)
N$87: Q9.3(D) U$57.3(PD1)
N$89: Q9.5(Y) R6.2 U$64.1(1-TRANS+)
N$90: Q9.6(Z) R6.1 U$64.2(2-TRANS-)
N$91: Q9.7(B) R8.2 U$64.6(6-RECEIVE-)
N$93: Q9.8(A) R8.1 U$64.3(3+RECEIVE+)
S_12V-2: U$57.6(PD4) ; also sheet 3
S_MAIN: U$57.4(PD2) ; also sheet 1
S_MC1: U$57.14(PB0) ; also sheet 5
S_MC2: U$57.13(PD7) ; also sheet 5
S_MC3: U$57.12(PD6) ; also sheet 5
S_MC4: U$57.11(PD5) ; also sheet 5
S_MC5: U$57.16(PB2) ; also sheet 5
S_MC6: U$57.17(PB3) ; also sheet 5
S_POE: U$57.5(PD3) ; also sheet 3
S_V5-2: U$57.18(PB4) ; also sheet 2
S_V12-1: U$57.19(PB5) ; also sheet 3
S_V24AUX: U$57.15(PB1) ; also sheet 6
V1: C16.1 Q8.1(VIN) ; also sheet 1
VA5: C11.1 C12.2 C13.1 C51.2 Q8.3(VOUT) Q9.1(VCC) R1.2 U$13.1(VIN) U$57.7(VCC) U$57.20(AVCC) ; also sheet 1
Unconnected: U$57.21(AREF) U$64.4(4-DC+) U$64.5(5-DC++)

### Notes on the sheet
- Analog Inputs

## Library data of the parts
C1-C13 C16 C18-C21 C23-C25 C27-C55 C57 C68-C76 = Lib_Passive:C_CAP
C14 C15 C17 C22 C26 C56 C58-C67 C77-C79 = PCB0M1:C_POL: Alum Elect. Cap with 10mm diameter, 5mm lead spacing and 0.7mm lead diameter
D1-D10 = Lib_Katlyn:D_1.5KE480A: Zener Diode
H1-H4 = Lib_TH:H_MNTHOLE
J1 = PCB0M1:J_MC32857: SWITCH, TACTILE, SPST-NO, 50mA, THD
J2 = PCB0M1:J_0399700102: High Current Power Connector
J3-J8 U$14 U$26 U$31 U$36 U$40 U$44 U$52-U$55 U$72 = PCB0M1:J_1546074-2
JOLTEON-12V-1 MAGNEMITE-12V-2 PICKACHU-5V RAICHU-5V-CRIT ZAPDOS-20V = PCB0M1:Q_PTN78020: TI DC/DC converter 36Vin - Adjustable output
L1-L10 = PCB0M1:L_29F0429: Through-Hole Ferrite Bead 285 Ohm @ 100MHz
N1-N8 = PCB0M1:RJ45-2PORT: RJSAE-5080-02 RJ45 Connector 1 on 1 port
P1 = SCC Fib:TME1215S
Q1 Q3-Q7 Q15 = Lib_Katlyn:U_FDPF045N10A: N-FET
Q2 Q13 = PCB0M1:Q_CSD18532KCS: 60V 100A N Channel MOSFET
Q8 Q18 = PCB0M1:Q_LDO: LDO with fixed ouput voltage
Q9 = PCB0M1:Q_LTC490: IC, RS422-RS485 DRVR
Q10-Q12 Q14 = PCB0M1:Q_2N7000: Small N-Channel MOSFET Logic Level
Q16 = PCB0M1:Q_IRS21851STR: 4A 600V 130ns High Side Driver
Q17 = PCB0M1:Q_INA28: 10Khz Bidirectional Current Sense Amplifier
R1 R6 R8 R10 R15 R16 R18 R20-R24 R28 R30-R32 = Lib_Passive:R_RES
R2-R5 R11 R12 R25 = Lib_TH:R
R7 = PCB0M1:R_FC4L110R001JER
R13 R14 R17 R19 R26 R27 R29 = PCB0M1:R_1/4WL: Standard 1/4W resistor package that has long leads to bridge traces
U$11 U$23 U$27 U$32 U$37 U$41 U$70 = PCB0M1:Q_MIC5021: MIC5021 High Side Driver with Electronic Breaker
U$13 = PCB0M1:Q_LM35: IC, TEMPERATURE SENSOR, 0.4°C, TO-92-3
U$45-U$50 U$73 = PCB0M1:R_2512
U$57 = PCB0M1:Q_ATMEGA328P: ATMEGA 328P in 28PIN PDIP package
U$64 = PCB0M1:RJ45
X1 = PCB0M1:X_HC49SCRYSTAL: CRYSTAL METAL CAN, 16MHZ, 18PF, HC-49/US